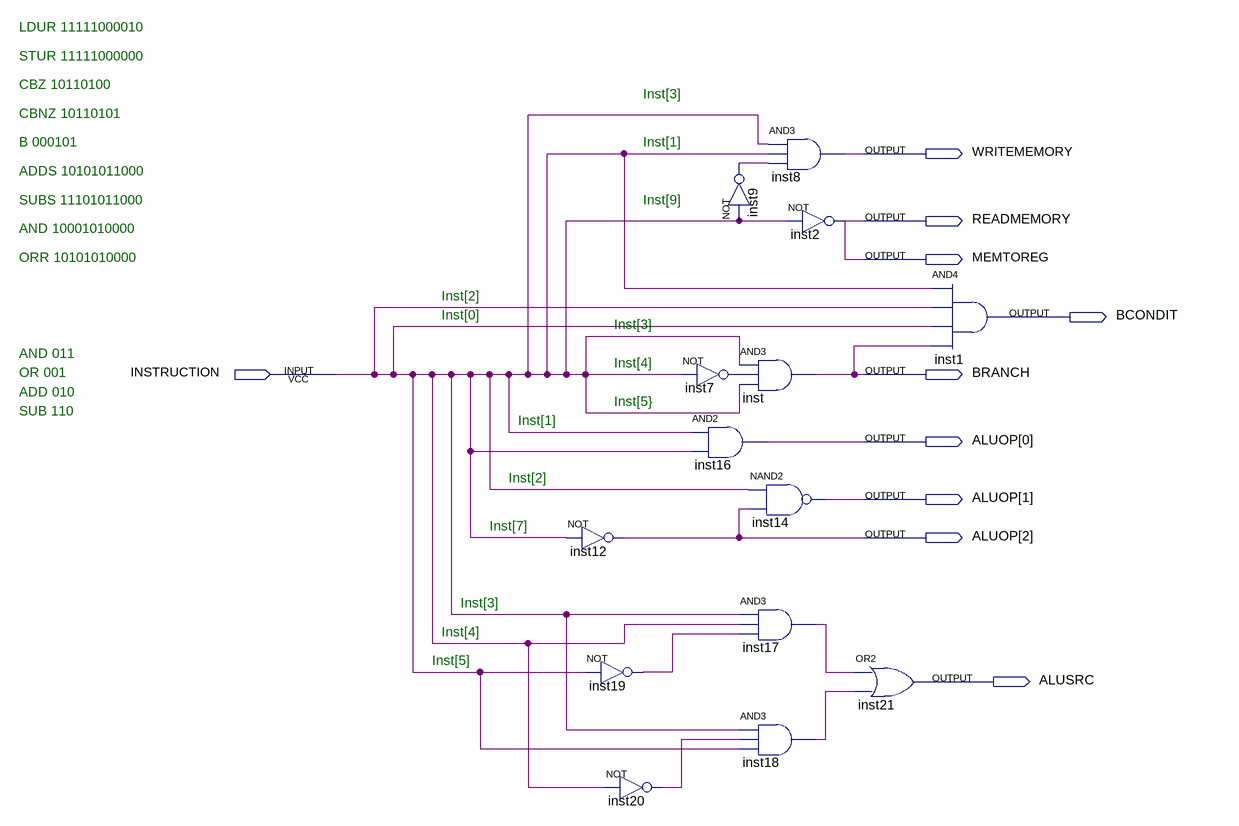
[diagram p0: schematic sheet]
// Quartus schematic Control.bdf as structural Verilog: 14 symbols, 10 pins
module Control (
  input  INSTRUCTION,
  output WRITEMEMORY,
  output READMEMORY,
  output MEMTOREG,
  output BCONDIT,
  output BRANCH,
  output [2:0] ALUOP,
  output ALUSRC
);

  wire inst7_out, inst9_out, inst17_out, inst18_out, inst19_out, inst20_out;

  not inst12 (ALUOP[2], INSTRUCTION);
  not inst19 (inst19_out, INSTRUCTION);
  not inst20 (inst20_out, INSTRUCTION);
  not inst9 (inst9_out, INSTRUCTION);
  and inst (BRANCH, INSTRUCTION, inst7_out, INSTRUCTION);
  not inst7 (inst7_out, INSTRUCTION);
  and inst16 (ALUOP[0], INSTRUCTION, INSTRUCTION);
  nand inst14 (ALUOP[1], INSTRUCTION, ALUOP[2]);
  and inst17 (inst17_out, INSTRUCTION, INSTRUCTION, inst19_out);
  and inst18 (inst18_out, INSTRUCTION, inst20_out, INSTRUCTION);
  and inst8 (WRITEMEMORY, INSTRUCTION, INSTRUCTION, inst9_out);
  not inst2 (MEMTOREG, INSTRUCTION);
  or inst21 (ALUSRC, inst17_out, inst18_out);
  and inst1 (BCONDIT, INSTRUCTION, INSTRUCTION, INSTRUCTION, BRANCH);

  assign READMEMORY = MEMTOREG;

  // Notes on the sheet:
  //   LDUR 11111000010
  //   STUR 11111000000
  //   CBZ 10110100
  //   Inst[3]
  //   CBNZ 10110101
  //   B 000101
  //   Inst[1]
  //   ADDS 10101011000
  //   SUBS 11101011000
  //   Inst[9]
  //   AND 10001010000
  //   ORR 10101010000
  //   Inst[2]
  //   Inst[0]
  //   Inst[3]
  //   AND 011
  //   Inst[4]
  //   OR 001
  //   ADD 010
  //   Inst[5}
  //   SUB 110
  //   Inst[1]
  //   Inst[2]
  //   Inst[7]
  //   Inst[3]
  //   Inst[4]
  //   Inst[5]
endmodule
